# Altium schematic sheet Sheet_relay.SchDoc
size A4
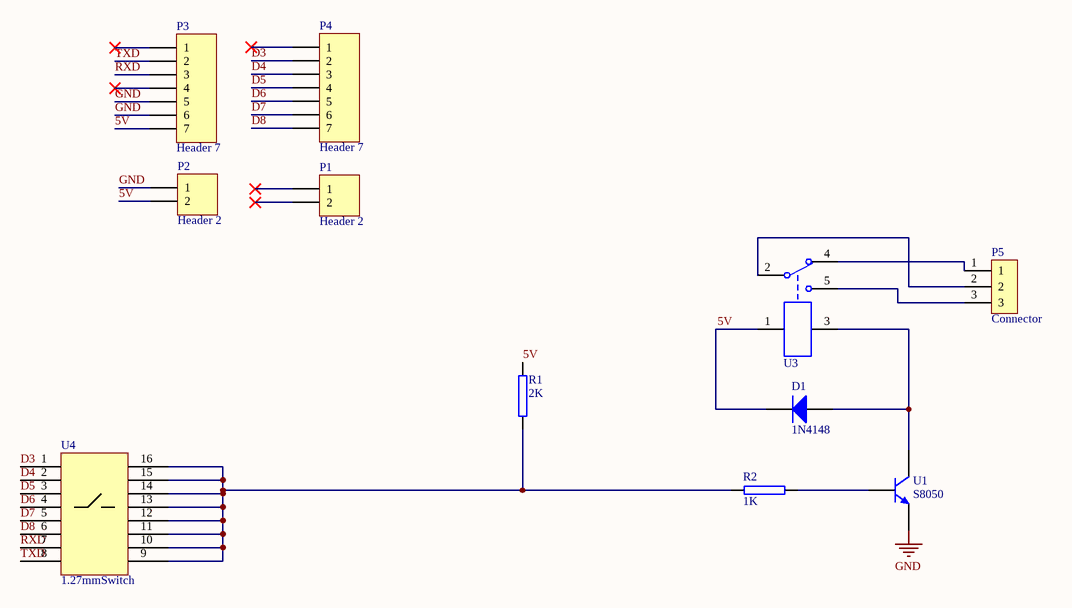
[diagram p0: Sheet_relay.SchDoc]

## Parts
D1  1N4148  [1n4148]
P1  Header 2  [HDR1X2]
P2  Header 2  [HDR1X2]
P3  Header 7  [HDR1X7]
P4  Header 7  [HDR1X7]
P5  Connector  [3p]
R1  2K  [R0603]
R2  1K  [R0603]
U1  S8050  [s8050]
U3  SRD-05VDC-SL-C  [Relay]  (value not drawn)
U4  1.27mmSwitch  [NumberSwitch]

## Nets
GND: P2.1 P3.5 P3.6 U1.2(E)
5V: D1.2(K) P2.2 P3.7 R1.2 U3.1
D3: P4.2 U4.1
D4: P4.3 U4.2
D5: P4.4 U4.3
D6: P4.5 U4.4
D7: P4.6 U4.5
D8: P4.7 U4.6
RXD: P3.3 U4.7
TXD: P3.2 U4.8
NetD1_1: D1.1(A) U1.3(C) U3.3
NetP5_1: P5.1 U3.4
NetP5_2: P5.2 U3.2
NetP5_3: P5.3 U3.5
NetR1_1: R1.1 R2.1 U4.9 U4.10 U4.11 U4.12 U4.13 U4.14 U4.15 U4.16
NetR2_2: R2.2 U1.1(B)

Not connected (* = marked no-connect by the designer): P1 1* 2*; P3 1* 4*; P4 1*

## Library data of the parts
D1 = 1N4148: 二极管
P1 P2 = Header 2: Header, 2-Pin; LatestRevisionDate: 17-Jul-2002; LatestRevisionNote: Re-released for DXP Platform.; Publisher: Altium Limited
P3 P4 = Header 7: Header, 7-Pin; LatestRevisionDate: 17-Jul-2002; LatestRevisionNote: Re-released for DXP Platform.; Publisher: Altium Limited
P5 = 3P: 3P端子5mm
R1 R2 = R0603: 贴片电阻
U1 = S8050: 三极管
U3 = Relay: 继电器
U4 = NumberSwitch: 拨码开关